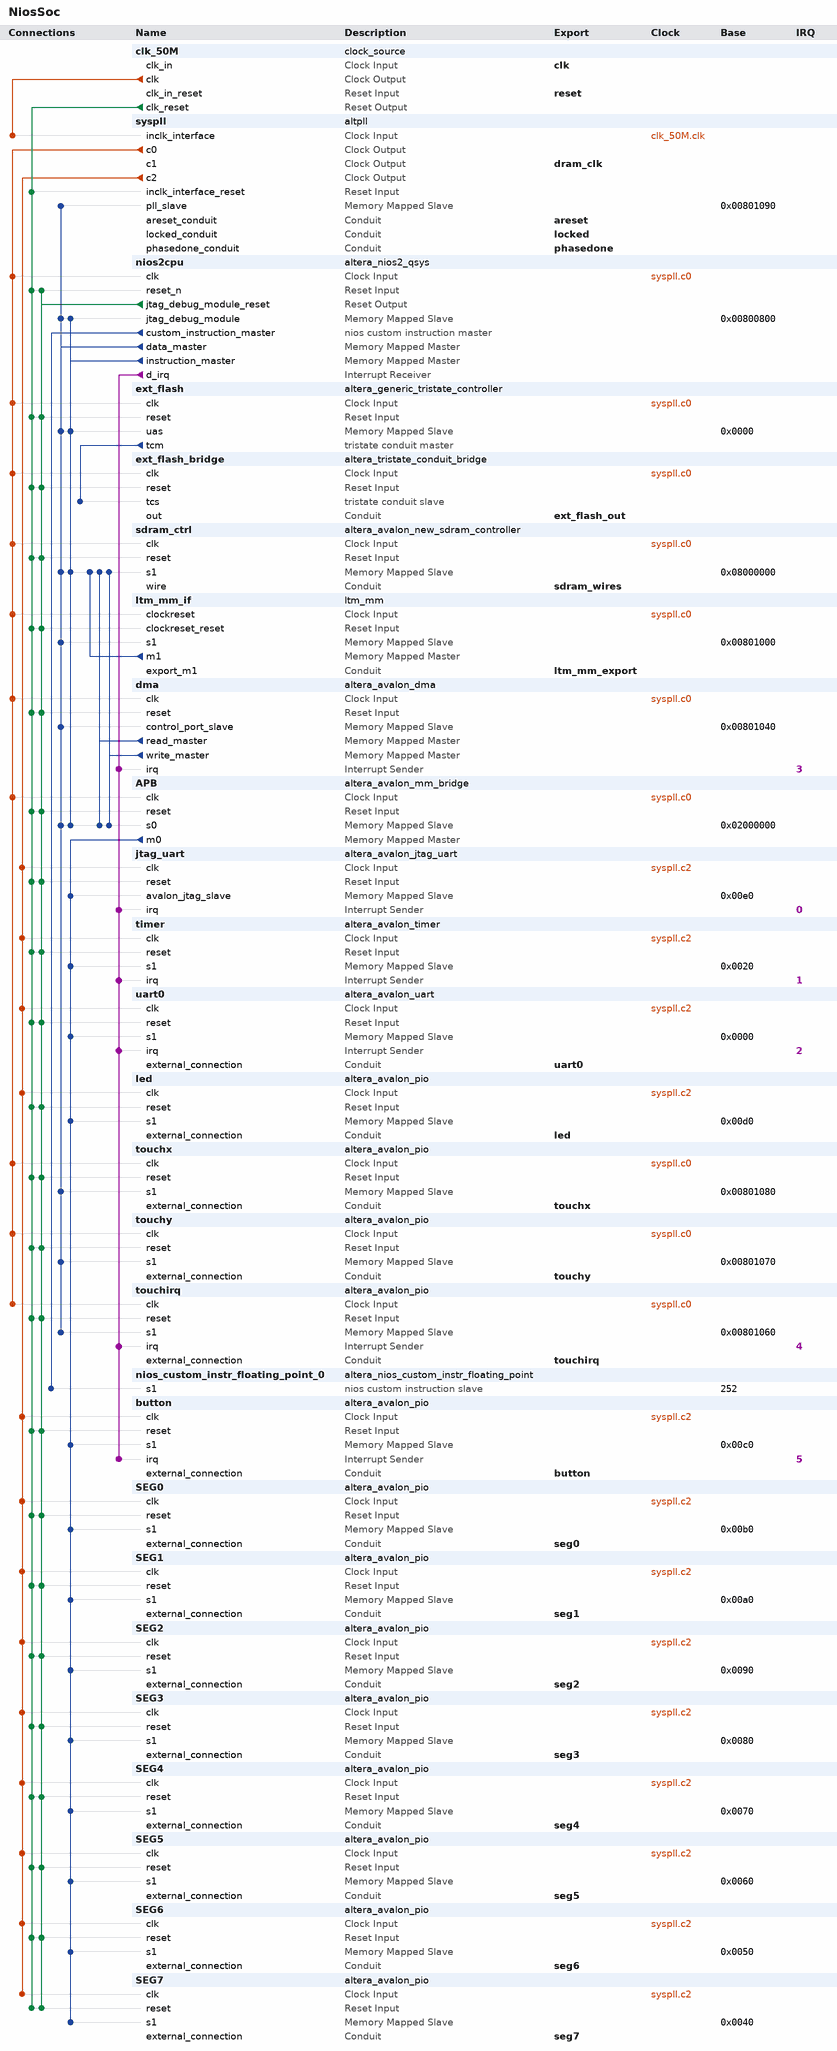
[diagram p0: system contents]
# Platform Designer (Qsys) system NiosSoc, Cyclone II EP2C70F896C6
# Parameters at their usual value, and those the tool derives, are not listed.
package require -exact qsys 13.0.1.99.2
create_system NiosSoc
set_project_property DEVICE_FAMILY {Cyclone II}
set_project_property DEVICE EP2C70F896C6

add_instance clk_50M clock_source 13.0
set_instance_parameter_value clk_50M clockFrequency 50000000

add_instance syspll altpll 13.0
set_instance_parameter_value syspll INCLK0_INPUT_FREQUENCY 20000
set_instance_parameter_value syspll GATE_LOCK_SIGNAL NO
set_instance_parameter_value syspll VALID_LOCK_MULTIPLIER 1
set_instance_parameter_value syspll INVALID_LOCK_MULTIPLIER 5
set_instance_parameter_value syspll CLK0_MULTIPLY_BY 3
set_instance_parameter_value syspll CLK1_MULTIPLY_BY 3
set_instance_parameter_value syspll CLK2_MULTIPLY_BY 1
set_instance_parameter_value syspll CLK0_DIVIDE_BY 1
set_instance_parameter_value syspll CLK1_DIVIDE_BY 1
set_instance_parameter_value syspll CLK2_DIVIDE_BY 5
set_instance_parameter_value syspll CLK1_PHASE_SHIFT -1667
set_instance_parameter_value syspll CLK2_PHASE_SHIFT 0
set_instance_parameter_value syspll CLK1_DUTY_CYCLE 50
set_instance_parameter_value syspll CLK2_DUTY_CYCLE 50
set_instance_parameter_value syspll PORT_clk1 PORT_USED
set_instance_parameter_value syspll PORT_clk2 PORT_USED
set_instance_parameter_value syspll PORT_clk3 PORT_UNUSED
set_instance_parameter_value syspll PORT_ARESET PORT_UNUSED
set_instance_parameter_value syspll PORT_LOCKED PORT_UNUSED

add_instance nios2cpu altera_nios2_qsys 13.0
set_instance_parameter_value nios2cpu resetSlave ext_flash.uas
set_instance_parameter_value nios2cpu mmu_TLBMissExcSlave None
set_instance_parameter_value nios2cpu exceptionSlave sdram_ctrl.s1
set_instance_parameter_value nios2cpu breakSlave nios2cpu.jtag_debug_module
set_instance_parameter_value nios2cpu impl Tiny
set_instance_parameter_value nios2cpu icache_size 4096

add_instance ext_flash altera_generic_tristate_controller 13.0
set_instance_parameter_value ext_flash TCM_ADDRESS_W 23
set_instance_parameter_value ext_flash TCM_DATA_W 16
set_instance_parameter_value ext_flash TCM_BYTEENABLE_W 2
set_instance_parameter_value ext_flash TCM_READ_WAIT 160
set_instance_parameter_value ext_flash TCM_WRITE_WAIT 160
set_instance_parameter_value ext_flash TCM_SETUP_WAIT 50
set_instance_parameter_value ext_flash TCM_DATA_HOLD 5
set_instance_parameter_value ext_flash TCM_MAX_PENDING_READ_TRANSACTIONS 3
set_instance_parameter_value ext_flash TCM_TURNAROUND_TIME 2
set_instance_parameter_value ext_flash TCM_TIMING_UNITS 0
set_instance_parameter_value ext_flash TCM_READLATENCY 2
set_instance_parameter_value ext_flash TCM_SYMBOLS_PER_WORD 2
set_instance_parameter_value ext_flash USE_READ 1
set_instance_parameter_value ext_flash USE_BEGINTRANSFER 0
set_instance_parameter_value ext_flash USE_BYTEENABLE 0
set_instance_parameter_value ext_flash USE_OUTPUTENABLE 0
set_instance_parameter_value ext_flash ACTIVE_LOW_READ 1
set_instance_parameter_value ext_flash ACTIVE_LOW_BYTEENABLE 0
set_instance_parameter_value ext_flash ACTIVE_LOW_OUTPUTENABLE 0
set_instance_parameter_value ext_flash ACTIVE_LOW_BEGINTRANSFER 0
set_instance_parameter_value ext_flash CHIPSELECT_THROUGH_READLATENCY 0
set_instance_parameter_value ext_flash MODULE_ASSIGNMENT_KEYS embeddedsw.configuration.hwClassnameDriverSupportList,embeddedsw.configuration.hwClassnameDriverSupportDefault,embeddedsw.CMacro.SETUP_VALUE,embeddedsw.CMacro.WAIT_VALUE,embeddedsw.CMacro.HOLD_VALUE,embeddedsw.CMacro.TIMING_UNITS,embeddedsw.CMacro.SIZE,embeddedsw.memoryInfo.MEM_INIT_DATA_WIDTH,embeddedsw.memoryInfo.HAS_BYTE_LANE,embeddedsw.memoryInfo.IS_FLASH,embeddedsw.memoryInfo.GENERATE_DAT_SYM,embeddedsw.memoryInfo.GENERATE_FLASH,embeddedsw.memoryInfo.DAT_SYM_INSTALL_DIR,embeddedsw.memoryInfo.FLASH_INSTALL_DIR
set_instance_parameter_value ext_flash MODULE_ASSIGNMENT_VALUES altera_avalon_lan91c111:altera_avalon_cfi_flash,altera_avalon_cfi_flash,40,160,40,ns,8388608u,16,0,1,1,1,SIM_DIR,APP_DIR
set_instance_parameter_value ext_flash INTERFACE_ASSIGNMENT_KEYS embeddedsw.configuration.isFlash,embeddedsw.configuration.isMemoryDevice,embeddedsw.configuration.isNonVolatileStorage
set_instance_parameter_value ext_flash INTERFACE_ASSIGNMENT_VALUES 1,1,1

add_instance ext_flash_bridge altera_tristate_conduit_bridge 13.0

add_instance sdram_ctrl altera_avalon_new_sdram_controller 13.0.1.99.2
set_instance_parameter_value sdram_ctrl TAC 5.5
set_instance_parameter_value sdram_ctrl TRCD 20.0
set_instance_parameter_value sdram_ctrl TRP 20.0
set_instance_parameter_value sdram_ctrl casLatency 3
set_instance_parameter_value sdram_ctrl columnWidth 9
set_instance_parameter_value sdram_ctrl dataWidth 32
set_instance_parameter_value sdram_ctrl generateSimulationModel false
set_instance_parameter_value sdram_ctrl model single_Micron_MT48LC4M32B2_7_chip
set_instance_parameter_value sdram_ctrl numberOfBanks 4
set_instance_parameter_value sdram_ctrl numberOfChipSelects 1
set_instance_parameter_value sdram_ctrl powerUpDelay 200.0
set_instance_parameter_value sdram_ctrl refreshPeriod 7.8125
set_instance_parameter_value sdram_ctrl rowWidth 13

add_instance ltm_mm_if ltm_mm 1.0
set_instance_parameter_value ltm_mm_if LTM_ADDRESS 50331648

add_instance dma altera_avalon_dma 13.0.1.99.2
set_instance_parameter_value dma allowByteTransactions true
set_instance_parameter_value dma allowDoubleWordTransactions true
set_instance_parameter_value dma allowHalfWordTransactions true
set_instance_parameter_value dma allowQuadWordTransactions true
set_instance_parameter_value dma burstEnable true
set_instance_parameter_value dma fifoDepth 32
set_instance_parameter_value dma maxBurstSize 128
set_instance_parameter_value dma minimumDmaTransactionRegisterWidth 13
set_instance_parameter_value dma useRegistersForFIFO true

add_instance APB altera_avalon_mm_bridge 13.0
set_instance_parameter_value APB DATA_WIDTH 32
set_instance_parameter_value APB ADDRESS_WIDTH 10
set_instance_parameter_value APB ADDRESS_UNITS SYMBOLS
set_instance_parameter_value APB MAX_PENDING_RESPONSES 4

add_instance jtag_uart altera_avalon_jtag_uart 13.0.1.99.2
set_instance_parameter_value jtag_uart simInteractiveOptions NO_INTERACTIVE_WINDOWS

add_instance timer altera_avalon_timer 13.0.1.99.2
set_instance_parameter_value timer period 1
set_instance_parameter_value timer periodUnits USEC

add_instance uart0 altera_avalon_uart 13.0.1.99.2
set_instance_parameter_value uart0 baud 115200
set_instance_parameter_value uart0 dataBits 8
set_instance_parameter_value uart0 fixedBaud true
set_instance_parameter_value uart0 parity NONE
set_instance_parameter_value uart0 stopBits 1

add_instance led altera_avalon_pio 13.0.1.99.2
set_instance_parameter_value led direction Output
set_instance_parameter_value led width 9

add_instance touchx altera_avalon_pio 13.0.1.99.2
set_instance_parameter_value touchx direction Input
set_instance_parameter_value touchx simDoTestBenchWiring true
set_instance_parameter_value touchx width 12

add_instance touchy altera_avalon_pio 13.0.1.99.2
set_instance_parameter_value touchy direction Input
set_instance_parameter_value touchy simDoTestBenchWiring true
set_instance_parameter_value touchy width 12

add_instance touchirq altera_avalon_pio 13.0.1.99.2
set_instance_parameter_value touchirq captureEdge true
set_instance_parameter_value touchirq direction Input
set_instance_parameter_value touchirq generateIRQ true
set_instance_parameter_value touchirq irqType EDGE
set_instance_parameter_value touchirq simDoTestBenchWiring true
set_instance_parameter_value touchirq width 1

add_instance nios_custom_instr_floating_point_0 altera_nios_custom_instr_floating_point 13.0

add_instance button altera_avalon_pio 13.0.1.99.2
set_instance_parameter_value button captureEdge true
set_instance_parameter_value button direction Input
set_instance_parameter_value button edgeType FALLING
set_instance_parameter_value button generateIRQ true
set_instance_parameter_value button irqType EDGE
set_instance_parameter_value button width 4

add_instance SEG0 altera_avalon_pio 13.0.1.99.2
set_instance_parameter_value SEG0 direction Output
set_instance_parameter_value SEG0 width 8

add_instance SEG1 altera_avalon_pio 13.0.1.99.2
set_instance_parameter_value SEG1 direction Output
set_instance_parameter_value SEG1 width 8

add_instance SEG2 altera_avalon_pio 13.0.1.99.2
set_instance_parameter_value SEG2 direction Output
set_instance_parameter_value SEG2 width 8

add_instance SEG3 altera_avalon_pio 13.0.1.99.2
set_instance_parameter_value SEG3 direction Output
set_instance_parameter_value SEG3 width 8

add_instance SEG4 altera_avalon_pio 13.0.1.99.2
set_instance_parameter_value SEG4 direction Output
set_instance_parameter_value SEG4 width 8

add_instance SEG5 altera_avalon_pio 13.0.1.99.2
set_instance_parameter_value SEG5 direction Output
set_instance_parameter_value SEG5 width 8

add_instance SEG6 altera_avalon_pio 13.0.1.99.2
set_instance_parameter_value SEG6 direction Output
set_instance_parameter_value SEG6 width 8

add_instance SEG7 altera_avalon_pio 13.0.1.99.2
set_instance_parameter_value SEG7 direction Output
set_instance_parameter_value SEG7 width 8

# connections
add_connection clk_50M.clk syspll.inclk_interface clock
add_connection syspll.c0 APB.clk clock
add_connection syspll.c0 dma.clk clock
add_connection syspll.c0 ext_flash.clk clock
add_connection syspll.c0 ext_flash_bridge.clk clock
add_connection syspll.c0 ltm_mm_if.clockreset clock
add_connection syspll.c0 nios2cpu.clk clock
add_connection syspll.c0 sdram_ctrl.clk clock
add_connection syspll.c0 touchirq.clk clock
add_connection syspll.c0 touchx.clk clock
add_connection syspll.c0 touchy.clk clock
add_connection syspll.c2 button.clk clock
add_connection syspll.c2 jtag_uart.clk clock
add_connection syspll.c2 led.clk clock
add_connection syspll.c2 SEG0.clk clock
add_connection syspll.c2 SEG1.clk clock
add_connection syspll.c2 SEG2.clk clock
add_connection syspll.c2 SEG3.clk clock
add_connection syspll.c2 SEG4.clk clock
add_connection syspll.c2 SEG5.clk clock
add_connection syspll.c2 SEG6.clk clock
add_connection syspll.c2 SEG7.clk clock
add_connection syspll.c2 timer.clk clock
add_connection syspll.c2 uart0.clk clock
add_connection clk_50M.clk_reset APB.reset reset
add_connection clk_50M.clk_reset button.reset reset
add_connection clk_50M.clk_reset dma.reset reset
add_connection clk_50M.clk_reset ext_flash.reset reset
add_connection clk_50M.clk_reset ext_flash_bridge.reset reset
add_connection clk_50M.clk_reset jtag_uart.reset reset
add_connection clk_50M.clk_reset led.reset reset
add_connection clk_50M.clk_reset ltm_mm_if.clockreset_reset reset
add_connection clk_50M.clk_reset nios2cpu.reset_n reset
add_connection clk_50M.clk_reset sdram_ctrl.reset reset
add_connection clk_50M.clk_reset SEG0.reset reset
add_connection clk_50M.clk_reset SEG1.reset reset
add_connection clk_50M.clk_reset SEG2.reset reset
add_connection clk_50M.clk_reset SEG3.reset reset
add_connection clk_50M.clk_reset SEG4.reset reset
add_connection clk_50M.clk_reset SEG5.reset reset
add_connection clk_50M.clk_reset SEG6.reset reset
add_connection clk_50M.clk_reset SEG7.reset reset
add_connection clk_50M.clk_reset syspll.inclk_interface_reset reset
add_connection clk_50M.clk_reset timer.reset reset
add_connection clk_50M.clk_reset touchirq.reset reset
add_connection clk_50M.clk_reset touchx.reset reset
add_connection clk_50M.clk_reset touchy.reset reset
add_connection clk_50M.clk_reset uart0.reset reset
add_connection nios2cpu.jtag_debug_module_reset APB.reset reset
add_connection nios2cpu.jtag_debug_module_reset button.reset reset
add_connection nios2cpu.jtag_debug_module_reset dma.reset reset
add_connection nios2cpu.jtag_debug_module_reset ext_flash.reset reset
add_connection nios2cpu.jtag_debug_module_reset ext_flash_bridge.reset reset
add_connection nios2cpu.jtag_debug_module_reset jtag_uart.reset reset
add_connection nios2cpu.jtag_debug_module_reset led.reset reset
add_connection nios2cpu.jtag_debug_module_reset ltm_mm_if.clockreset_reset reset
add_connection nios2cpu.jtag_debug_module_reset nios2cpu.reset_n reset
add_connection nios2cpu.jtag_debug_module_reset sdram_ctrl.reset reset
add_connection nios2cpu.jtag_debug_module_reset SEG0.reset reset
add_connection nios2cpu.jtag_debug_module_reset SEG1.reset reset
add_connection nios2cpu.jtag_debug_module_reset SEG2.reset reset
add_connection nios2cpu.jtag_debug_module_reset SEG3.reset reset
add_connection nios2cpu.jtag_debug_module_reset SEG4.reset reset
add_connection nios2cpu.jtag_debug_module_reset SEG5.reset reset
add_connection nios2cpu.jtag_debug_module_reset SEG6.reset reset
add_connection nios2cpu.jtag_debug_module_reset SEG7.reset reset
add_connection nios2cpu.jtag_debug_module_reset timer.reset reset
add_connection nios2cpu.jtag_debug_module_reset touchirq.reset reset
add_connection nios2cpu.jtag_debug_module_reset touchx.reset reset
add_connection nios2cpu.jtag_debug_module_reset touchy.reset reset
add_connection nios2cpu.jtag_debug_module_reset uart0.reset reset
add_connection APB.m0 button.s1 avalon
set_connection_parameter_value APB.m0/button.s1 baseAddress 0x00c0
add_connection APB.m0 jtag_uart.avalon_jtag_slave avalon
set_connection_parameter_value APB.m0/jtag_uart.avalon_jtag_slave baseAddress 0x00e0
add_connection APB.m0 led.s1 avalon
set_connection_parameter_value APB.m0/led.s1 baseAddress 0x00d0
add_connection APB.m0 SEG0.s1 avalon
set_connection_parameter_value APB.m0/SEG0.s1 baseAddress 0x00b0
add_connection APB.m0 SEG1.s1 avalon
set_connection_parameter_value APB.m0/SEG1.s1 baseAddress 0x00a0
add_connection APB.m0 SEG2.s1 avalon
set_connection_parameter_value APB.m0/SEG2.s1 baseAddress 0x0090
add_connection APB.m0 SEG3.s1 avalon
set_connection_parameter_value APB.m0/SEG3.s1 baseAddress 0x0080
add_connection APB.m0 SEG4.s1 avalon
set_connection_parameter_value APB.m0/SEG4.s1 baseAddress 0x0070
add_connection APB.m0 SEG5.s1 avalon
set_connection_parameter_value APB.m0/SEG5.s1 baseAddress 0x0060
add_connection APB.m0 SEG6.s1 avalon
set_connection_parameter_value APB.m0/SEG6.s1 baseAddress 0x0050
add_connection APB.m0 SEG7.s1 avalon
set_connection_parameter_value APB.m0/SEG7.s1 baseAddress 0x0040
add_connection APB.m0 timer.s1 avalon
set_connection_parameter_value APB.m0/timer.s1 baseAddress 0x0020
add_connection APB.m0 uart0.s1 avalon
set_connection_parameter_value APB.m0/uart0.s1 baseAddress 0x0000
add_connection dma.read_master APB.s0 avalon
set_connection_parameter_value dma.read_master/APB.s0 baseAddress 0x02000000
add_connection dma.read_master sdram_ctrl.s1 avalon
set_connection_parameter_value dma.read_master/sdram_ctrl.s1 baseAddress 0x08000000
add_connection dma.write_master APB.s0 avalon
set_connection_parameter_value dma.write_master/APB.s0 baseAddress 0x02000000
add_connection dma.write_master sdram_ctrl.s1 avalon
set_connection_parameter_value dma.write_master/sdram_ctrl.s1 baseAddress 0x08000000
add_connection ltm_mm_if.m1 sdram_ctrl.s1 avalon
set_connection_parameter_value ltm_mm_if.m1/sdram_ctrl.s1 baseAddress 0x08000000
add_connection nios2cpu.data_master APB.s0 avalon
set_connection_parameter_value nios2cpu.data_master/APB.s0 baseAddress 0x02000000
add_connection nios2cpu.data_master dma.control_port_slave avalon
set_connection_parameter_value nios2cpu.data_master/dma.control_port_slave baseAddress 0x00801040
add_connection nios2cpu.data_master ext_flash.uas avalon
set_connection_parameter_value nios2cpu.data_master/ext_flash.uas baseAddress 0x0000
add_connection nios2cpu.data_master ltm_mm_if.s1 avalon
set_connection_parameter_value nios2cpu.data_master/ltm_mm_if.s1 baseAddress 0x00801000
add_connection nios2cpu.data_master nios2cpu.jtag_debug_module avalon
set_connection_parameter_value nios2cpu.data_master/nios2cpu.jtag_debug_module baseAddress 0x00800800
add_connection nios2cpu.data_master sdram_ctrl.s1 avalon
set_connection_parameter_value nios2cpu.data_master/sdram_ctrl.s1 baseAddress 0x08000000
add_connection nios2cpu.data_master syspll.pll_slave avalon
set_connection_parameter_value nios2cpu.data_master/syspll.pll_slave baseAddress 0x00801090
add_connection nios2cpu.data_master touchirq.s1 avalon
set_connection_parameter_value nios2cpu.data_master/touchirq.s1 baseAddress 0x00801060
add_connection nios2cpu.data_master touchx.s1 avalon
set_connection_parameter_value nios2cpu.data_master/touchx.s1 baseAddress 0x00801080
add_connection nios2cpu.data_master touchy.s1 avalon
set_connection_parameter_value nios2cpu.data_master/touchy.s1 baseAddress 0x00801070
add_connection nios2cpu.instruction_master APB.s0 avalon
set_connection_parameter_value nios2cpu.instruction_master/APB.s0 baseAddress 0x02000000
add_connection nios2cpu.instruction_master ext_flash.uas avalon
set_connection_parameter_value nios2cpu.instruction_master/ext_flash.uas baseAddress 0x0000
add_connection nios2cpu.instruction_master nios2cpu.jtag_debug_module avalon
set_connection_parameter_value nios2cpu.instruction_master/nios2cpu.jtag_debug_module baseAddress 0x00800800
add_connection nios2cpu.instruction_master sdram_ctrl.s1 avalon
set_connection_parameter_value nios2cpu.instruction_master/sdram_ctrl.s1 baseAddress 0x08000000
add_connection nios2cpu.d_irq button.irq interrupt
set_connection_parameter_value nios2cpu.d_irq/button.irq irqNumber 5
add_connection nios2cpu.d_irq dma.irq interrupt
set_connection_parameter_value nios2cpu.d_irq/dma.irq irqNumber 3
add_connection nios2cpu.d_irq jtag_uart.irq interrupt
set_connection_parameter_value nios2cpu.d_irq/jtag_uart.irq irqNumber 0
add_connection nios2cpu.d_irq timer.irq interrupt
set_connection_parameter_value nios2cpu.d_irq/timer.irq irqNumber 1
add_connection nios2cpu.d_irq touchirq.irq interrupt
set_connection_parameter_value nios2cpu.d_irq/touchirq.irq irqNumber 4
add_connection nios2cpu.d_irq uart0.irq interrupt
set_connection_parameter_value nios2cpu.d_irq/uart0.irq irqNumber 2
add_connection nios2cpu.custom_instruction_master nios_custom_instr_floating_point_0.s1 nios_custom_instruction
set_connection_parameter_value nios2cpu.custom_instruction_master/nios_custom_instr_floating_point_0.s1 CIName nios_custom_instr_floating_point_0
set_connection_parameter_value nios2cpu.custom_instruction_master/nios_custom_instr_floating_point_0.s1 baseAddress 252
add_connection ext_flash.tcm ext_flash_bridge.tcs tristate_conduit

# exported interfaces
add_interface clk clock sink
set_interface_property clk EXPORT_OF clk_50M.clk_in
add_interface reset reset sink
set_interface_property reset EXPORT_OF clk_50M.clk_in_reset
add_interface sdram_wires conduit end
set_interface_property sdram_wires EXPORT_OF sdram_ctrl.wire
add_interface uart0 conduit end
set_interface_property uart0 EXPORT_OF uart0.external_connection
add_interface led conduit end
set_interface_property led EXPORT_OF led.external_connection
add_interface areset conduit end
set_interface_property areset EXPORT_OF syspll.areset_conduit
add_interface locked conduit end
set_interface_property locked EXPORT_OF syspll.locked_conduit
add_interface phasedone conduit end
set_interface_property phasedone EXPORT_OF syspll.phasedone_conduit
add_interface dram_clk clock source
set_interface_property dram_clk EXPORT_OF syspll.c1
add_interface ltm_mm_export conduit end
set_interface_property ltm_mm_export EXPORT_OF ltm_mm_if.export_m1
add_interface touchirq conduit end
set_interface_property touchirq EXPORT_OF touchirq.external_connection
add_interface touchy conduit end
set_interface_property touchy EXPORT_OF touchy.external_connection
add_interface touchx conduit end
set_interface_property touchx EXPORT_OF touchx.external_connection
add_interface ext_flash_out conduit end
set_interface_property ext_flash_out EXPORT_OF ext_flash_bridge.out
add_interface button conduit end
set_interface_property button EXPORT_OF button.external_connection
add_interface seg0 conduit end
set_interface_property seg0 EXPORT_OF SEG0.external_connection
add_interface seg1 conduit end
set_interface_property seg1 EXPORT_OF SEG1.external_connection
add_interface seg2 conduit end
set_interface_property seg2 EXPORT_OF SEG2.external_connection
add_interface seg3 conduit end
set_interface_property seg3 EXPORT_OF SEG3.external_connection
add_interface seg4 conduit end
set_interface_property seg4 EXPORT_OF SEG4.external_connection
add_interface seg5 conduit end
set_interface_property seg5 EXPORT_OF SEG5.external_connection
add_interface seg6 conduit end
set_interface_property seg6 EXPORT_OF SEG6.external_connection
add_interface seg7 conduit end
set_interface_property seg7 EXPORT_OF SEG7.external_connection

set_interconnect_requirement {$system} qsys_mm.clockCrossingAdapter HANDSHAKE
set_interconnect_requirement {$system} qsys_mm.maxAdditionalLatency 1

save_system NiosSoc.qsys
